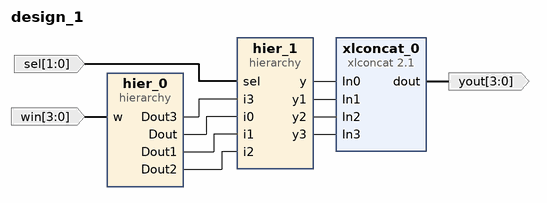
[diagram p0: block diagram of the top level]
# Vivado block design design_1, xc7a100tcsg324-1, Vivado 2023.2
create_bd_design design_1

create_bd_port -dir I -from 3 -to 0 win
create_bd_port -dir I -from 1 -to 0 sel
create_bd_port -dir O -from 3 -to 0 yout

create_bd_cell -type hier hier_0
create_bd_cell -type ip -vlnv xilinx.com:ip:xlconcat:2.1 xlconcat_0
set_property -dict {CONFIG.NUM_PORTS 4} [get_bd_cells xlconcat_0]
create_bd_cell -type hier hier_1

# ---- hierarchy /hier_0 ----
current_bd_instance /hier_0
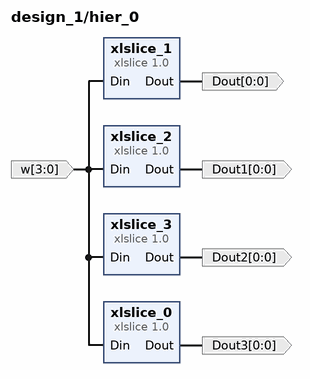
[diagram p1: block diagram inside /hier_0]
create_bd_pin -dir I -from 3 -to 0 w
create_bd_pin -dir O -from 0 -to 0 Dout
create_bd_pin -dir O -from 0 -to 0 Dout1
create_bd_pin -dir O -from 0 -to 0 Dout2
create_bd_pin -dir O -from 0 -to 0 Dout3

create_bd_cell -type ip -vlnv xilinx.com:ip:xlslice:1.0 xlslice_1
set_property -dict {CONFIG.DIN_FROM 1 CONFIG.DIN_TO 1 CONFIG.DIN_WIDTH 4} [get_bd_cells xlslice_1]
create_bd_cell -type ip -vlnv xilinx.com:ip:xlslice:1.0 xlslice_2
set_property -dict {CONFIG.DIN_FROM 2 CONFIG.DIN_TO 2 CONFIG.DIN_WIDTH 4} [get_bd_cells xlslice_2]
create_bd_cell -type ip -vlnv xilinx.com:ip:xlslice:1.0 xlslice_3
set_property -dict {CONFIG.DIN_FROM 3 CONFIG.DIN_TO 3 CONFIG.DIN_WIDTH 4} [get_bd_cells xlslice_3]
create_bd_cell -type ip -vlnv xilinx.com:ip:xlslice:1.0 xlslice_0
set_property -dict {CONFIG.DIN_WIDTH 4} [get_bd_cells xlslice_0]

# ---- hierarchy /hier_1 ----
current_bd_instance /hier_1
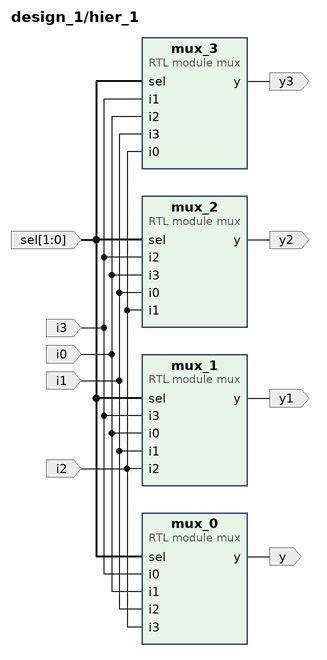
[diagram p2: block diagram inside /hier_1]
create_bd_pin -dir I i3
create_bd_pin -dir I i0
create_bd_pin -dir I i1
create_bd_pin -dir I i2
create_bd_pin -dir I -from 1 -to 0 sel
create_bd_pin -dir O y
create_bd_pin -dir O y1
create_bd_pin -dir O y2
create_bd_pin -dir O y3

create_bd_cell -type module -reference mux mux_0
create_bd_cell -type module -reference mux mux_1
create_bd_cell -type module -reference mux mux_2
create_bd_cell -type module -reference mux mux_3

# ---- connections ----

current_bd_instance /hier_0
connect_bd_net [get_bd_pins w] [get_bd_pins xlslice_0/Din] [get_bd_pins xlslice_2/Din] [get_bd_pins xlslice_3/Din] [get_bd_pins xlslice_1/Din]
connect_bd_net [get_bd_pins xlslice_0/Dout] [get_bd_pins Dout3]
connect_bd_net [get_bd_pins xlslice_1/Dout] [get_bd_pins Dout]
connect_bd_net [get_bd_pins xlslice_2/Dout] [get_bd_pins Dout1]
connect_bd_net [get_bd_pins xlslice_3/Dout] [get_bd_pins Dout2]

current_bd_instance /hier_1
connect_bd_net [get_bd_pins mux_0/y] [get_bd_pins y]
connect_bd_net [get_bd_pins mux_1/y] [get_bd_pins y1]
connect_bd_net [get_bd_pins mux_2/y] [get_bd_pins y2]
connect_bd_net [get_bd_pins mux_3/y] [get_bd_pins y3]
connect_bd_net [get_bd_pins sel] [get_bd_pins mux_0/sel] [get_bd_pins mux_1/sel] [get_bd_pins mux_2/sel] [get_bd_pins mux_3/sel]
connect_bd_net -net xlslice_0_Dout [get_bd_pins i3] [get_bd_pins mux_0/i0] [get_bd_pins mux_1/i3] [get_bd_pins mux_2/i2] [get_bd_pins mux_3/i1]
connect_bd_net -net xlslice_1_Dout [get_bd_pins i0] [get_bd_pins mux_0/i1] [get_bd_pins mux_1/i0] [get_bd_pins mux_2/i3] [get_bd_pins mux_3/i2]
connect_bd_net -net xlslice_2_Dout [get_bd_pins i1] [get_bd_pins mux_0/i2] [get_bd_pins mux_1/i1] [get_bd_pins mux_2/i0] [get_bd_pins mux_3/i3]
connect_bd_net -net xlslice_3_Dout [get_bd_pins i2] [get_bd_pins mux_0/i3] [get_bd_pins mux_1/i2] [get_bd_pins mux_2/i1] [get_bd_pins mux_3/i0]

current_bd_instance /
connect_bd_net -net mux_0_y [get_bd_pins hier_1/y] [get_bd_pins xlconcat_0/In0]
connect_bd_net -net mux_1_y [get_bd_pins hier_1/y1] [get_bd_pins xlconcat_0/In1]
connect_bd_net -net mux_2_y [get_bd_pins hier_1/y2] [get_bd_pins xlconcat_0/In2]
connect_bd_net -net mux_3_y [get_bd_pins hier_1/y3] [get_bd_pins xlconcat_0/In3]
connect_bd_net [get_bd_ports sel] [get_bd_pins hier_1/sel]
connect_bd_net -net w_1 [get_bd_ports win] [get_bd_pins hier_0/w]
connect_bd_net [get_bd_pins xlconcat_0/dout] [get_bd_ports yout]
connect_bd_net -net xlslice_0_Dout [get_bd_pins hier_0/Dout3] [get_bd_pins hier_1/i3]
connect_bd_net -net xlslice_1_Dout [get_bd_pins hier_0/Dout] [get_bd_pins hier_1/i0]
connect_bd_net -net xlslice_2_Dout [get_bd_pins hier_0/Dout1] [get_bd_pins hier_1/i1]
connect_bd_net -net xlslice_3_Dout [get_bd_pins hier_0/Dout2] [get_bd_pins hier_1/i2]

validate_bd_design
save_bd_design
